# EAGLE schematic sd9_redraw (EAGLE 9.6.0)
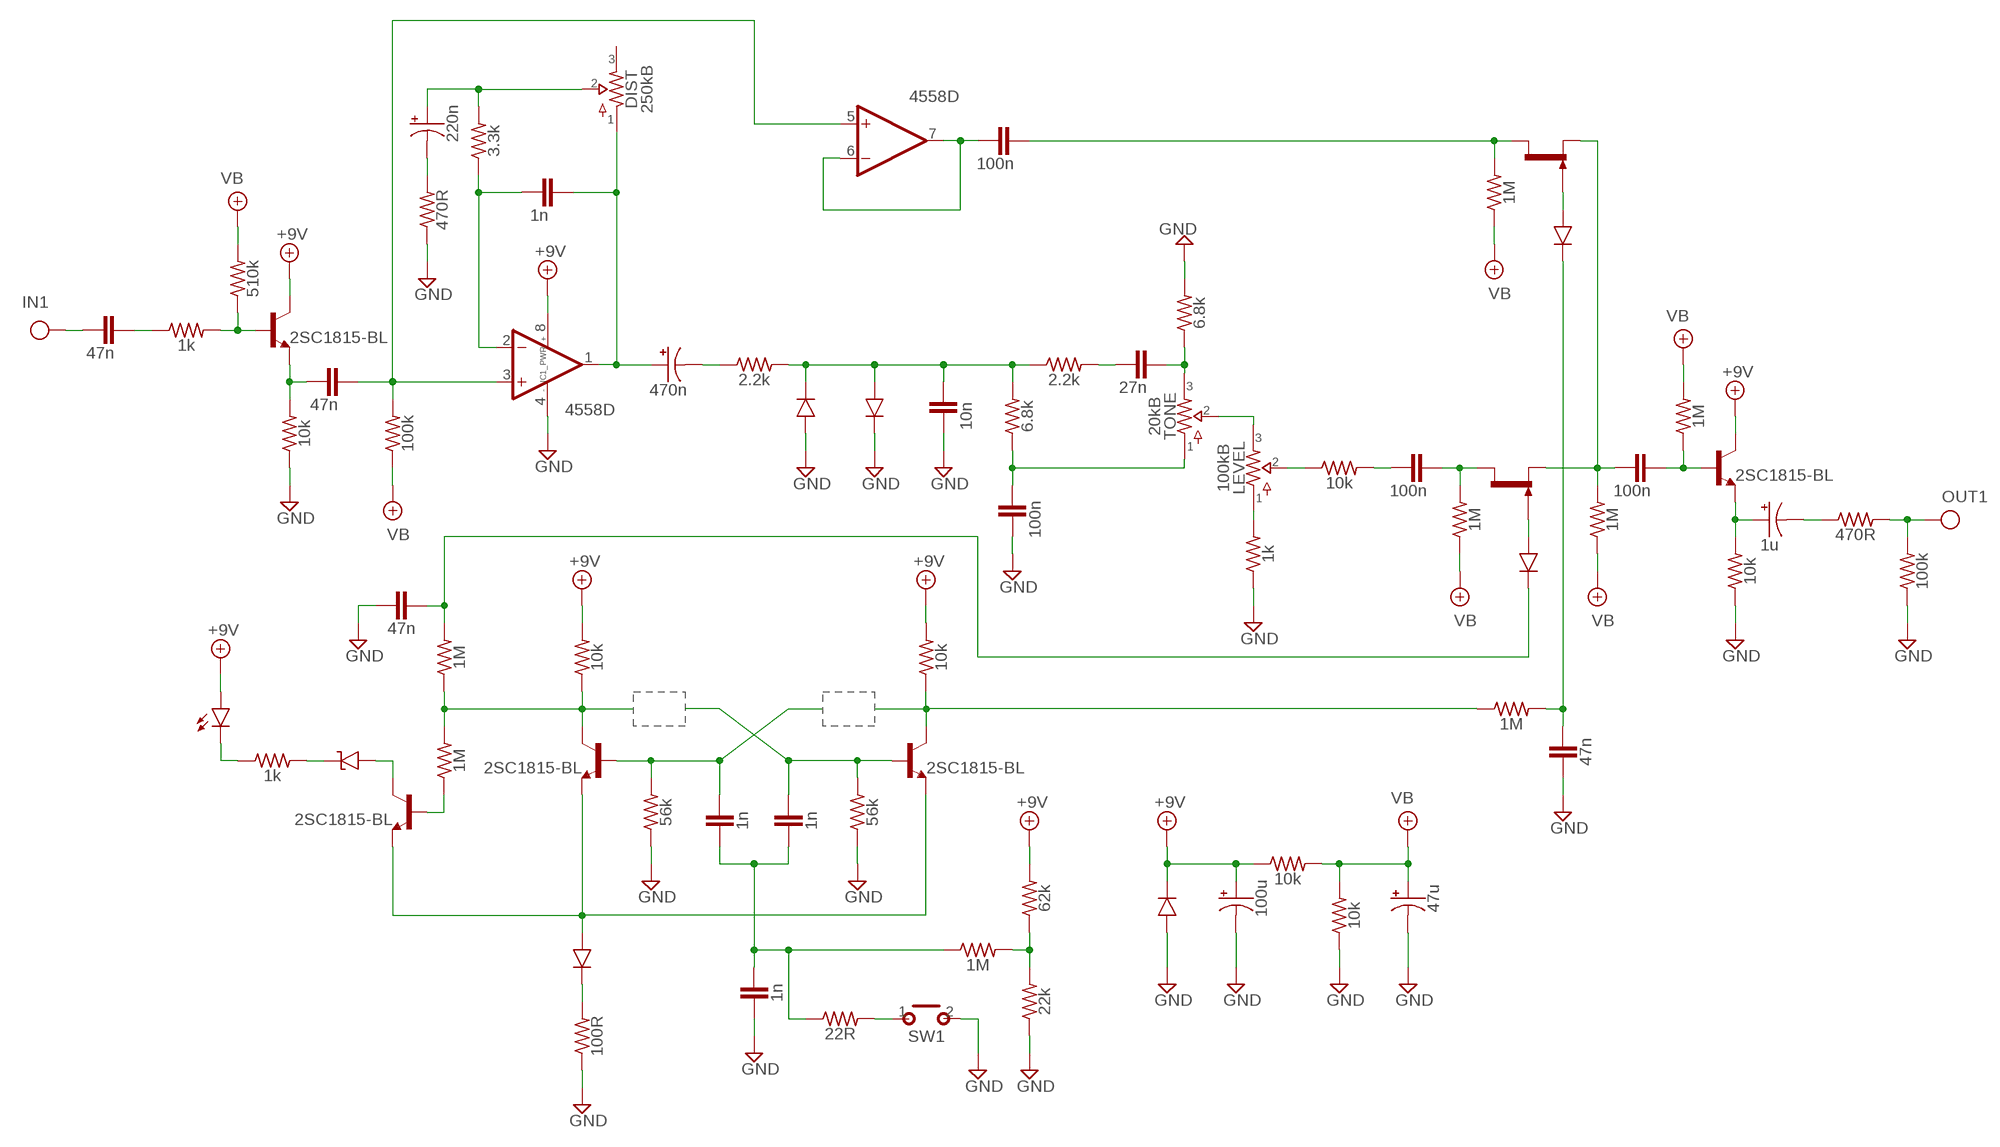
[diagram p0: schematic, sheet 1]

## Parts
C1  100u  0500  [050_020]
C2  47u  0500  [050_020]
C3  47n  CER/FILMBOX.1  [BOX_SMALL]
C4  47n  CER/FILMBOX.1  [BOX_SMALL]
C5  1n  CER/FILMBOX.1  [BOX_SMALL]
C6  220n  0500  [050_020]
C7  470n  0500  [050_020]
C8  10n  CER/FILMBOX.1  [BOX_SMALL]
C9  100n  CER/FILMBOX.1  [BOX_SMALL]
C10  27n  CER/FILMBOX.1  [BOX_SMALL]
C11  100n  CER/FILMBOX.1  [BOX_SMALL]
C12  100n  CER/FILMBOX.1  [BOX_SMALL]
C13  1u  0500  [050_020]
C14  1n  CER/FILMBOX.1  [BOX_SMALL]
C15  100n  CER/FILMBOX.1  [BOX_SMALL]
C30  47n  CER/FILMBOX.1  [BOX_SMALL]
C32  1n  CER/FILMBOX.1  [BOX_SMALL]
C34  1n  CER/FILMBOX.1  [BOX_SMALL]
C36  47n  CER/FILMBOX.1  [BOX_SMALL]
D1  DO41.2  [DO41-2]
D2  DO41.2  [DO41-2]
D3  DO41.2  [DO41-2]
D4  DO41.2  [DO41-2]
D5  DO41.2  [DO41-2]
D6  DO41.2  [DO41-2]
D7  ZENER.2  [DO41-2]
D8  LED  [3MM_D]
DIST  250kB  POTS16MM  [16MM]
IC1  4558D  DUALTH  [DIL0]
LEVEL  100kB  POTS16MM  [16MM]
Q1  2SC1815-BL  2N3904  [TO92-]
Q2  2SK30A-Y  2SK170  [TO92-]
Q3  2SK30A-Y  2SK170  [TO92-]
Q4  2SC1815-BL  2N3904  [TO92-]
Q5  2SC1815-BL  2SC828A  [TO92-]
Q30  2SC1815-BL  2SC828A  [TO92-]
Q31  2SC1815-BL  2SC828A  [TO92-]
R1  10k  R_.3B  [R0207/3]
R2  10k  R_.3B  [R0207/3]
R3  1k  R_.3B  [R0207/3]
R4  510k  R_.3B  [R0207/3]
R5  10k  R_.3B  [R0207/3]
R6  100k  R_.3B  [R0207/3]
R7  3.3k  R_.3B  [R0207/3]
R8  470R  R_.3B  [R0207/3]
R9  2.2k  R_.3B  [R0207/3]
R10  2.2k  R_.3B  [R0207/3]
R11  6.8k  R_.3B  [R0207/3]
R12  6.8k  R_.3B  [R0207/3]
R13  1M  R_.3B  [R0207/3]
R14  1M  R_.3B  [R0207/3]
R15  1M  R_.3B  [R0207/3]
R16  1M  R_.3B  [R0207/3]
R17  10k  R_.3B  [R0207/3]
R18  470R  R_.3B  [R0207/3]
R19  100k  R_.3B  [R0207/3]
R20  22R  R_.3B  [R0207/3]
R21  1M  R_.3B  [R0207/3]
R22  62k  R_.3B  [R0207/3]
R23  22k  R_.3B  [R0207/3]
R24  100R  R_.3B  [R0207/3]
R25  1M  R_.3B  [R0207/3]
R26  1k  R_.3B  [R0207/3]
R27  1k  R_.3B  [R0207/3]
R28  10k  R_.3B  [R0207/3]
R60  1M  R_.3B  [R0207/3]
R61  10k  R_.3B  [R0207/3]
R62  56k  R_.3B  [R0207/3]
R65  56k  R_.3B  [R0207/3]
R66  10k  R_.3B  [R0207/3]
R69  1M  R_.3B  [R0207/3]
SW1  MOMENTARY  [SPST]
TONE  20kB  POTS16MM  [16MM]

## Nets
+9V: C1.+ D1.C D8.ANODE(A) IC1.8(_PWR:V+) Q1.1(C) Q4.1(C) R1.1 R22.2 R61.2 R66.2
GND: C1.- C2.- C8.2 C9.2 C14.2 C30.2 C36.2 D1.A D2.A D3.C IC1.4(_PWR:V-) R2.1 R5.1 R8.1 R12.2 R17.1 R19.1 R23.1 R24.1 R27.1 R62.1 R65.1 SW1.2(S)
IN: C3.2
N$2: C3.1 R3.1
N$3: Q1.2(B) R3.2 R4.1
N$4: C4.2 Q1.3(E) R5.2
N$5: C4.1 IC1.3(_A:+IN) IC1.5(_B:+IN) R6.2
N$6: C5.2 IC1.2(_A:-IN) R7.1
N$7: C5.1 C7.+ DIST.1 IC1.1(_A:OUT)
N$8: C6.+ DIST.2 R7.2
N$9: C6.- R8.2
N$10: C7.- R9.1
N$11: C8.1 D2.C D3.A R9.2 R10.1 R11.2
N$12: LEVEL.3 TONE.2
N$13: C10.2 R10.2
N$14: C10.1 R12.1 TONE.3
N$15: C9.1 R11.1 TONE.1
N$16: C11.2 IC1.6(_B:-IN) IC1.7(_B:OUT)
N$17: C11.1 Q3.3(D) R15.2
N$18: C12.1 Q4.2(B) R16.1
N$19: C12.2 Q2.1(S) Q3.1(S) R14.2
N$20: C15.1 Q2.3(D) R13.2
N$21: C13.+ Q4.3(E) R17.2
N$22: C13.- R18.1
N$24: R20.2 SW1.1(P)
N$25: D4.A Q3.2(G)
N$26: D5.A Q2.2(G)
N$27: D6.A Q5.3(E) Q30.3(E) Q31.3(E)
N$28: Q30.2(C) R25.2 R60.1 R61.1
N$29: Q5.1(B) R25.1
N$30: D7.A Q5.2(C)
N$31: Q31.2(C) R66.1 R69.1
N$32: C32.1 Q30.1(B) R62.2
N$33: D7.C R26.2
N$34: C34.1 Q31.1(B) R65.2
N$35: C14.1 C32.2 C34.2 R20.1 R21.1
N$36: D8.P$1(C) R26.1
N$37: D6.C R24.2
N$38: LEVEL.1 R27.2
N$39: R21.2 R22.1 R23.2
N$40: LEVEL.2 R28.1
N$41: C15.2 R28.2
N$62: C36.1 D4.C R69.2
N$72: C30.1 D5.C R60.2
OUT: R18.2 R19.2
VB: C2.+ R1.2 R2.2 R4.2 R6.1 R13.1 R14.1 R15.1 R16.2
Unconnected: DIST.3

## Library data of the parts
C1 C2 C6 C7 C13 = pedals-capacitors-elec:050
C3-C5 C8-C12 C14 C15 C30 C32 C34 C36 = pedals-capacitors-film:CER/FILM: 47 - 120pF Xicon Ceramic Disc 2.5mm lead spacing
D1-D6 = pedals-diodes:DO41: DO-41 Package Diodes: 1N4001 - 1N40019 Zener Diodes: 1N4728 - 1N4764
D7 = pedals-diodes:ZENER
D8 = pedals-diodes:LED
DIST LEVEL TONE = pedals-potentiometers:POTS
IC1 = pedals-integrated circuits:DUAL: OP AMP
Q1 Q4 = pedals-transistors:2N3904: NPN Transistor
Q2 Q3 = pedals-transistors:2SK170
Q5 Q30 Q31 = pedals-transistors:2SC828A
R1-R28 R60-R62 R65 R66 R69 = pedals-resistors:R_
SW1 = pedals-switches:MOMENTARY